# Altium project Roseta_Shield.PrjPCB
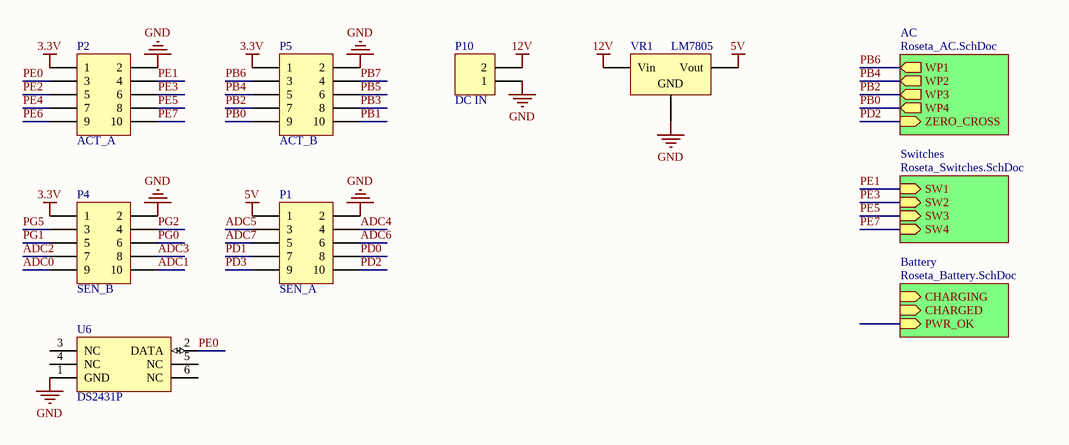
[diagram p0: Roseta_Shield.SchDoc]
4 sheets, 72 parts. Net scope: hierarchical (ports join the sheet entries above them; power ports are global).
Board file: Roseta_Shield.PcbDoc
Sheets:
  Roseta_Shield.SchDoc
    AC = Roseta_AC.SchDoc
    Switches = Roseta_Switches.SchDoc
    Battery = Roseta_Battery.SchDoc

## Sheet Roseta_Shield.SchDoc
size A4

### Parts
P1  SEN_A  [HDR2X5_Female_Slim]
P2  ACT_A  [HDR2X5_Female_Slim]
P4  SEN_B  [HDR2X5_Female_Slim]
P5  ACT_B  [HDR2X5_Female_Slim]
P10  DC IN  [TERMINAL BLOCK X2]
U6  DS2431P  [TSOC6]
VR1  LM7805  [TO254P1510-3_4N]

### Sub-sheets
AC = Roseta_AC.SchDoc: WP1 (out), WP2 (out), WP3 (out), WP4 (out), ZERO_CROSS (in)
Battery = Roseta_Battery.SchDoc: PWR_OK (in), CHARGED (in), CHARGING (in)
Switches = Roseta_Switches.SchDoc: SW1 (in), SW2 (in), SW3 (in), SW4 (in)

### Nets
3.3V: P2.1 P4.1 P5.1
5V: P1.1 VR1.3(Vout)
12V: P10.2 VR1.1(Vin)
GND: P1.2 P2.2 P4.2 P5.2 P10.1 U6.1(GND) VR1.2(GND)
ADC0: P4.9
ADC1: P4.10
ADC2: P4.7
ADC3: P4.8
ADC4: P1.4
ADC5: P1.3
ADC6: P1.6
ADC7: P1.5
PB0: P5.9 ; sheet AC/WP4
PB1: P5.10
PB2: P5.7 ; sheet AC/WP3
PB3: P5.8
PB4: P5.5 ; sheet AC/WP2
PB5: P5.6
PB6: P5.3 ; sheet AC/WP1
PB7: P5.4
PD0: P1.8
PD1: P1.7
PD2: P1.10 ; sheet AC/ZERO_CROSS
PD3: P1.9
PE0: P2.3 U6.2(DATA)
PE1: P2.4 ; sheet Switches/SW1
PE2: P2.5
PE3: P2.6 ; sheet Switches/SW2
PE4: P2.7
PE5: P2.8 ; sheet Switches/SW3
PE6: P2.9
PE7: P2.10 ; sheet Switches/SW4
PG0: P4.6
PG1: P4.5
PG2: P4.4
PG5: P4.3

Not connected (* = marked no-connect by the designer): U6 3(NC) 4(NC) 5(NC) 6(NC)

### Library data of the parts
P1 P2 P4 P5 = Header 5X2: Header, 5-Pin, Dual row; LatestRevisionDate: 17-Jul-2002; LatestRevisionNote: Re-released for DXP Platform.; Publisher: Altium Limited
P10 = Header 2: Header, 2-Pin; LatestRevisionDate: 17-Jul-2002; LatestRevisionNote: Re-released for DXP Platform.; Publisher: Altium Limited
U6 = DS2430AP: 256-Bit 1-Wire EEPROM; Note: Pin numbers 3-6 are Not Connected (NC); Published: 13-Oct-2000; LatestRevisionDate: 17-Jul-2002; LatestRevisionNote: Re-released for DXP Platform.; DatasheetVersion: 21-Oct-1999; PackageVersion: 1999; PackageReference: TSOC6; Publisher: Altium Limited; PackageDescription: Small Outline; 6 C-Bend Leads; Body Width 3.8 mm; Pitch 1.27 mm; ComponentLink1Description: Manufacturer Link; ComponentLink1URL: http://www.maxim-ic.com/; ComponentLink2Description: Datasheet; ComponentLink2URL: http://pdfserv.maxim-ic.com/en/ds/DS2430A.pdf
VR1 = Volt Reg: Voltage Regulator; Published: 24-Mar-1999; LatestRevisionDate: 29-May-2009; LatestRevisionNote: IPC-7351 Footprint Added.; PackageReference: D2PAK; Publisher: Altium Limited; PackageDescription: 3-Pin Transistor Outline Package 2.54 mm Pitch, 15.1 mm Lead Span

## Sheet Roseta_AC.SchDoc
size A4
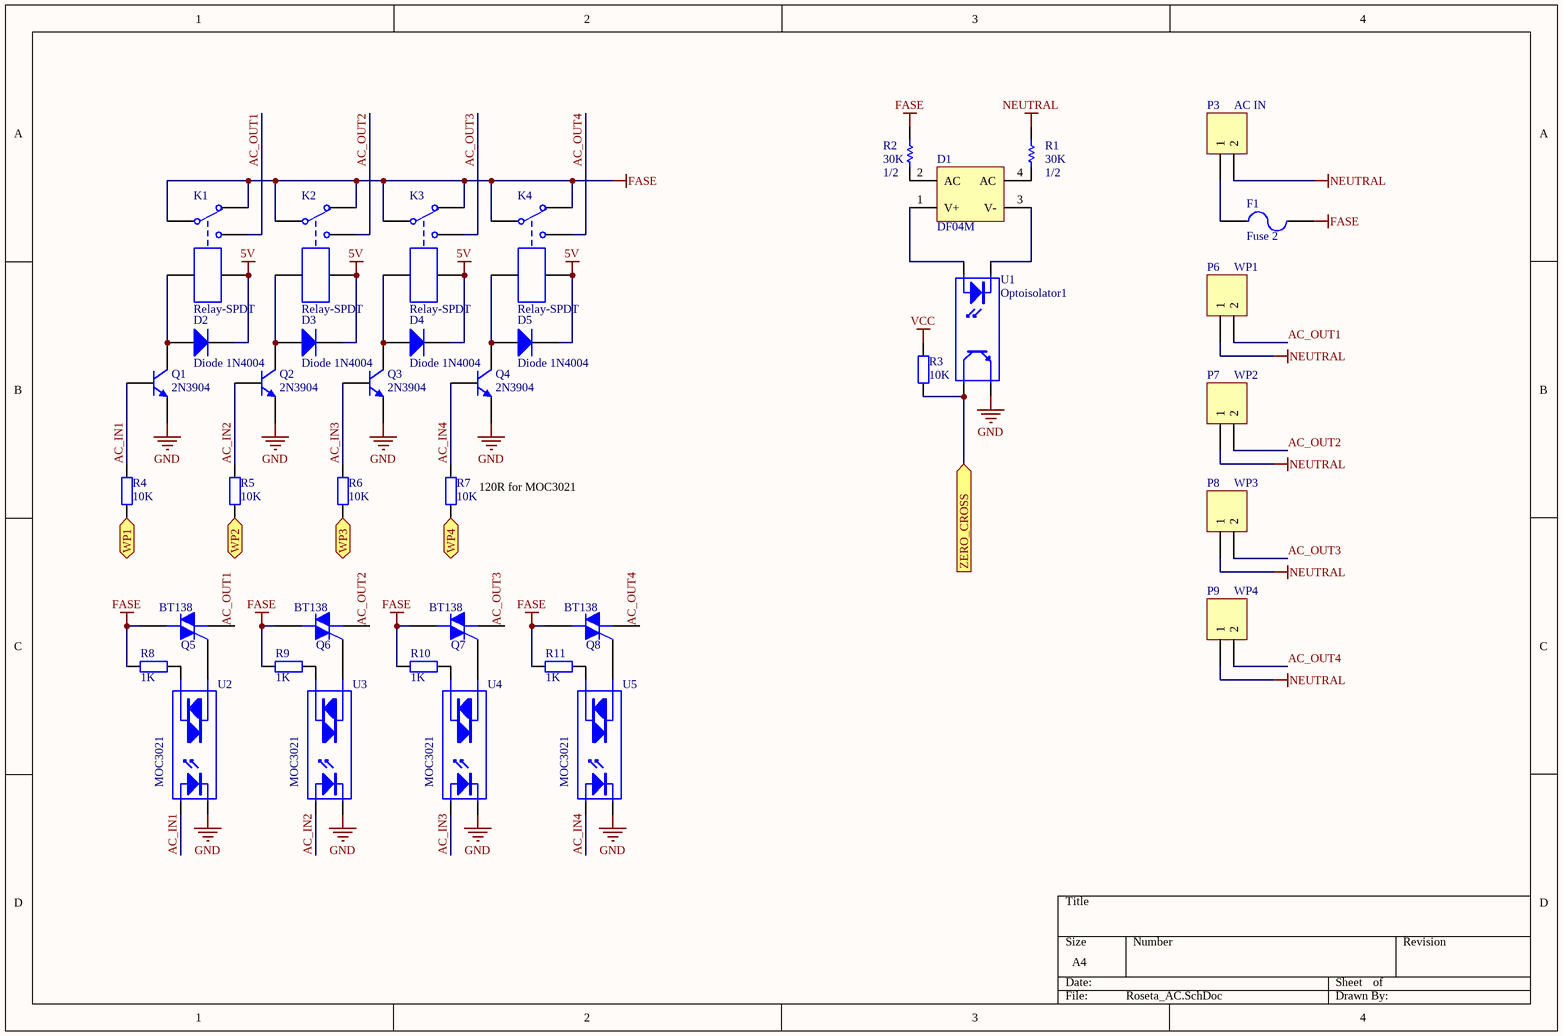
[diagram p1: Roseta_AC.SchDoc]

### Parts
D1  DF04M  [DF04M]
D2  Diode 1N4004  [1n4007]
D3  Diode 1N4004  [1n4007]
D4  Diode 1N4004  [1n4007]
D5  Diode 1N4004  [1n4007]
F1  Fuse 2  [PIN-W2/E2.8]
K1  Relay-SPDT  [RELAY-HRS4]
K2  Relay-SPDT  [RELAY-HRS4]
K3  Relay-SPDT  [RELAY-HRS4]
K4  Relay-SPDT  [RELAY-HRS4]
P3  AC IN  [TERMINAL BLOCK X2]
P6  WP1  [TERMINAL BLOCK X2]
P7  WP2  [TERMINAL BLOCK X2]
P8  WP3  [TERMINAL BLOCK X2]
P9  WP4  [TERMINAL BLOCK X2]
Q1  2N3904  [BCY-W3/E4]
Q2  2N3904  [BCY-W3/E4]
Q3  2N3904  [BCY-W3/E4]
Q4  2N3904  [BCY-W3/E4]
Q5  BT138  [221A-09]
Q6  BT138  [221A-09]
Q7  BT138  [221A-09]
Q8  BT138  [221A-09]
R1  1/2  value 30K  [AXIAL-0.3]
R2  1/2  value 30K  [AXIAL-0.3]
R3  value 10K  [1608[0603]]  (hidden comment: Res2)
R4  value 10K  [1608[0603]]  (hidden comment: Res2)
R5  value 10K  [1608[0603]]  (hidden comment: Res2)
R6  value 10K  [1608[0603]]  (hidden comment: Res2)
R7  value 10K  [1608[0603]]  (hidden comment: Res2)
R8  value 1K  [1608[0603]]  (hidden comment: Res2)
R9  value 1K  [1608[0603]]  (hidden comment: Res2)
R10  value 1K  [1608[0603]]  (hidden comment: Res2)
R11  value 1K  [1608[0603]]  (hidden comment: Res2)
U1  Optoisolator1  [DIP-6]
U2  MOC3021  [DIP-6]
U3  MOC3021  [DIP-6]
U4  MOC3021  [DIP-6]
U5  MOC3021  [DIP-6]

### Ports
WP1 (in), WP2 (in), WP3 (in), WP4 (in), ZERO_CROSS (in)

### Nets
5V: D2.2(K) D3.2(K) D4.2(K) D5.2(K) K1.5 K2.5 K3.5 K4.5
FASE: F1.1 K1.1 K1.2 K2.1 K2.2 K3.1 K3.2 K4.1 K4.2 Q5.2(M2) Q6.2(M2) Q7.2(M2) Q8.2(M2) R2.2 R8.2 R9.2 R10.2 R11.2
GND: Q1.1(E) Q2.1(E) Q3.1(E) Q4.1(E) U1.3(E) U2.2(K) U3.2(K) U4.2(K) U5.2(K)
NEUTRAL: P3.2 P6.1 P7.1 P8.1 P9.1 R1.2
VCC: R3.1
AC_IN1: Q1.2(B) R4.2 U2.1(A)
AC_IN2: Q2.2(B) R5.2 U3.1(A)
AC_IN3: Q3.2(B) R6.2 U4.1(A)
AC_IN4: Q4.2(B) R7.2 U5.1(A)
AC_OUT1: K1.3 P6.2 Q5.1(M1)
AC_OUT2: K2.3 P7.2 Q6.1(M1)
AC_OUT3: K3.3 P8.2 Q7.1(M1)
AC_OUT4: K4.3 P9.2 Q8.1(M1)
PB0: R7.1 ; port WP4
PB2: R6.1 ; port WP3
PB4: R5.1 ; port WP2
PB6: R4.1 ; port WP1
PD2: R3.2 U1.4(C) ; port ZERO_CROSS
NetD1_1: D1.1(V+) U1.1(A)
NetD1_2: D1.2(AC) R2.1
NetD1_3: D1.3(V-) U1.2(K)
NetD1_4: D1.4(AC) R1.1
NetD2_1: D2.1(A) K1.4 Q1.3(C)
NetD3_1: D3.1(A) K2.4 Q2.3(C)
NetD4_1: D4.1(A) K3.4 Q3.3(C)
NetD5_1: D5.1(A) K4.4 Q4.3(C)
NetF1_2: F1.2 P3.1
NetQ5_3: Q5.3(G) U2.4(A/K)
NetQ6_3: Q6.3(G) U3.4(A/K)
NetQ7_3: Q7.3(G) U4.4(A/K)
NetQ8_3: Q8.3(G) U5.4(A/K)
NetR8_1: R8.1 U2.3(A/K)
NetR9_1: R9.1 U3.3(A/K)
NetR10_1: R10.1 U4.3(A/K)
NetR11_1: R11.1 U5.3(A/K)

### Notes on the sheet
- (near R7) 120R for MOC3021

### Library data of the parts
D1 = Bridge2: Diode Bridge; Published: 24-Mar-1999; LatestRevisionDate: 17-Jul-2002; LatestRevisionNote: Re-released for DXP Platform.; PackageReference: D-46_6A; Publisher: Altium Limited
D2-D5 = Diode 1N4004: 1 Amp General Purpose Rectifier; Published: 8-Jun-2000; LatestRevisionDate: 17-Jul-2002; LatestRevisionNote: Re-released for DXP Platform.; DatasheetVersion: 1998; PackageVersion: Aug-1999; PackageReference: DO-41; Publisher: Altium Limited; Code_JEDEC: DO-204-AL; ComponentLink1Description: Manufacturer Link; ComponentLink1URL: http://www.fairchildsemi.com/; ComponentLink2Description: Datasheet; ComponentLink2URL: http://www.fairchildsemi.com/ds/1N%2F1N4001.pdf
F1 = Fuse 2: Fuse; Published: 8-Jun-2000; LatestRevisionDate: 17-Jul-2002; LatestRevisionNote: Re-released for DXP Platform.; PackageReference: PIN-W2/E2.8; Publisher: Altium Limited
K1-K4 = Relay-SPDT: Single-Pole Dual-Throw Relay; Published: 24-Mar-1999; LatestRevisionDate: 17-Jul-2002; LatestRevisionNote: Re-released for DXP Platform.; PackageReference: MODULE5B; Publisher: Altium Limited
P3 P6-P9 = Header 2: Header, 2-Pin; LatestRevisionDate: 17-Jul-2002; LatestRevisionNote: Re-released for DXP Platform.; Publisher: Altium Limited
Q1-Q4 = 2N3904: NPN General Purpose Amplifier; Published: 8-Jun-2000; LatestRevisionDate: 15-Jan-2003; LatestRevisionNote: PCB Footprint 'BCY-W3/D4.7' replaced; DatasheetVersion: 1997; PackageVersion: Sep-1998; PackageReference: TO-92A; Publisher: Altium Limited; Code_JEDEC: TO-92A; ComponentLink1Description: Manufacturer Link; ComponentLink1URL: http://www.fairchildsemi.com/; ComponentLink2Description: Datasheet; ComponentLink2URL: http://www.fairchildsemi.com/ds/2N%2F2N3904.pdf
Q5-Q8 = MAC15A6: Silicon Bidirectional Triode Thyristor; Note: Pin 2 is electrically connected to Pin 4 (TAB); Published: 29-Sep-2000; LatestRevisionDate: 17-Jul-2002; LatestRevisionNote: Re-released for DXP Platform.; DatasheetVersion: 1999; PackageVersion: 1997; PackageReference: 221A-09; Publisher: Altium Limited; PackageDescription: TO, Thru-Hole, Vertical, Heatsink Mounted; 3 In-Line Leads; Pitch 2.54 mm; Code_JEDEC: TO-262-AA; ComponentLink1Description: Manufacturer Link; ComponentLink1URL: http://www.onsemi.com/site/products/landing?taxonomyID=194; ComponentLink2Description: Datasheet; ComponentLink2URL: http://www.onsemi.com/pub/Collateral/MAC15A4-D.PDF
R1 R2 = Res1: Resistor; Published: 8-Jun-2000; LatestRevisionDate: 17-Jul-2002; LatestRevisionNote: Re-released for DXP Platform.; PackageReference: AXIAL-0.3; Publisher: Altium Limited
R3-R11 = Res2: Resistor; Published: 8-Jun-2000; LatestRevisionDate: 17-Jul-2002; LatestRevisionNote: Re-released for DXP Platform.; PackageReference: AXIAL-0.4; Publisher: Altium Limited
U1 = Optoisolator1: 4-Pin Phototransistor Optocoupler; pin to pad: 3>4 4>5; Published: 24-Mar-1999; LatestRevisionDate: 04-Mar-2005; LatestRevisionNote: Sch pins 3 & 4 Swapped.; DatasheetVersion: Nov-2003; PackageReference: DIP-4; Publisher: Altium Limited
U2-U5 = Opto TRIAC: Opto-Triac; pin to pad: 3>4 4>6; Published: 24-Mar-1999; LatestRevisionDate: 17-Jul-2002; LatestRevisionNote: Re-released for DXP Platform.; PackageReference: NPSIP4A; Publisher: Altium Limited

## Sheet Roseta_Switches.SchDoc
size A4
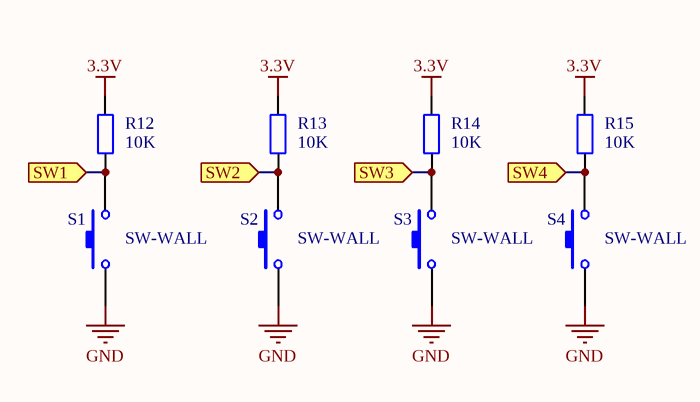
[diagram p2: Roseta_Switches.SchDoc]

### Parts
R12  value 10K  [1608[0603]]  (hidden comment: Res2)
R13  value 10K  [1608[0603]]  (hidden comment: Res2)
R14  value 10K  [1608[0603]]  (hidden comment: Res2)
R15  value 10K  [1608[0603]]  (hidden comment: Res2)
S1  SW-WALL  [TERMINAL BLOCK X2]
S2  SW-WALL  [TERMINAL BLOCK X2]
S3  SW-WALL  [TERMINAL BLOCK X2]
S4  SW-WALL  [TERMINAL BLOCK X2]

### Ports
SW1 (in), SW2 (in), SW3 (in), SW4 (in)

### Nets
3.3V: R12.1 R13.1 R14.1 R15.1
GND: S1.1 S2.1 S3.1 S4.1
PE1: R12.2 S1.2 ; port SW1
PE3: R13.2 S2.2 ; port SW2
PE5: R14.2 S3.2 ; port SW3
PE7: R15.2 S4.2 ; port SW4

### Library data of the parts
R12-R15 = Res2: Resistor; Published: 8-Jun-2000; LatestRevisionDate: 17-Jul-2002; LatestRevisionNote: Re-released for DXP Platform.; PackageReference: AXIAL-0.4; Publisher: Altium Limited
S1-S4 = SW-PB: Switch; Published: 24-Mar-1999; LatestRevisionDate: 17-Jul-2002; LatestRevisionNote: Re-released for DXP Platform.; PackageReference: SPST-2; Publisher: Altium Limited

## Sheet Roseta_Battery.SchDoc
size A4
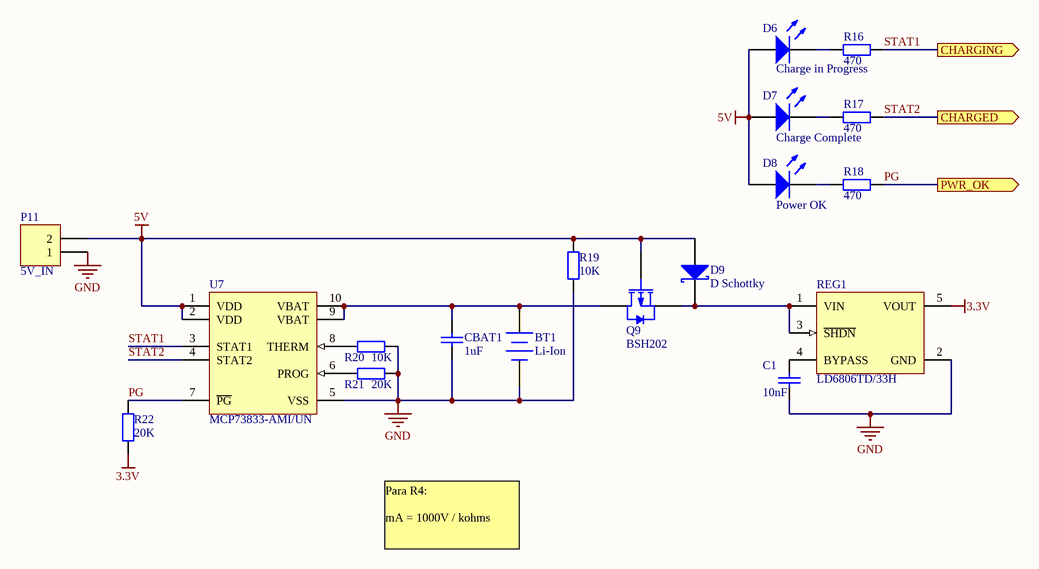
[diagram p3: Roseta_Battery.SchDoc]

### Parts
BT1  Li-Ion  [BAT-2]
C1  value 10nF  [1608[0603]]  (hidden comment: Cap)
CBAT1  value 1uF  [1608[0603]]  (hidden comment: Cap)
D6  Charge in Progress  [2013[0805]]
D7  Charge Complete  [2013[0805]]
D8  Power OK  [2013[0805]]
D9  D Schottky  [SOD123/X.85]
P11  5V_IN  [HDR1X2]
Q9  BSH202  [SOT95P240-3M]
R16  value 470  [1608[0603]]  (hidden comment: Res2)
R17  value 470  [1608[0603]]  (hidden comment: Res2)
R18  value 470  [1608[0603]]  (hidden comment: Res2)
R19  value 10K  [1608[0603]]  (hidden comment: Res2)
R20  value 10K  [1608[0603]]  (hidden comment: Res2)
R21  value 20K  [1608[0603]]  (hidden comment: Res2)
R22  value 20K  [1608[0603]]  (hidden comment: Res2)
REG1  LD6806TD/33H  [SOT-23-OT5_N]
U7  MCP73833-AMI/UN  [MSOP-UN10_N]

### Ports
CHARGED (out), CHARGING (out), PWR_OK (out)

### Nets
3.3V: R22.2 REG1.5(VOUT)
5V: D6.1 D7.1 D8.1 D9.1(A) P11.2 Q9.1(G) R19.1 U7.1(VDD) U7.2(VDD)
GND: BT1.2(-) C1.1 CBAT1.2 P11.1 R19.2 R20.1 R21.1 REG1.2(GND) U7.5(VSS)
PG: R18.2 R22.1 U7.7(~{PG}) ; port PWR_OK
STAT1: R16.2 U7.3(STAT1) ; port CHARGING
STAT2: R17.2 U7.4(STAT2) ; port CHARGED
NetBT1_1: BT1.1(+) CBAT1.1 Q9.3(D) U7.9(VBAT) U7.10(VBAT)
NetC1_2: C1.2 REG1.4(BYPASS)
NetD6_2: D6.2 R16.1
NetD7_2: D7.2 R17.1
NetD8_2: D8.2 R18.1
NetD9_2: D9.2(K) Q9.2(S) REG1.1(VIN) REG1.3(~{SHDN})
NetR20_2: R20.2 U7.8(THERM)
NetR21_2: R21.2 U7.6(PROG)

### Notes on the sheet
- Para R4:
  mA = 1000V / kohms

### Library data of the parts
BT1 = Battery: Multicell Battery; Published: 24-Mar-1999; LatestRevisionDate: 17-Jul-2002; LatestRevisionNote: Re-released for DXP Platform.; PackageReference: BAT-2; Publisher: Altium Limited
C1 CBAT1 = Cap: Capacitor; Published: 8-Jun-2000; LatestRevisionDate: 17-Jul-2002; LatestRevisionNote: Re-released for DXP Platform.; PackageReference: RAD-0.3; Publisher: Altium Limited
D6-D8 = LED SMD (0603)
D9 = D Schottky: Schottky Diode; Published: 8-Jun-2000; LatestRevisionDate: 17-Jul-2002; LatestRevisionNote: Re-released for DXP Platform.; PackageReference: SMB; Publisher: Altium Limited; Code_JEDEC: DO-214-AA
P11 = Header 2: Header, 2-Pin; LatestRevisionDate: 17-Jul-2002; LatestRevisionNote: Re-released for DXP Platform.; Publisher: Altium Limited
Q9 = BSH202: P-channel Enhancement Mode MOSFET; Published: 17-Sep-2003; LatestRevisionDate: 12-Dec-2006; LatestRevisionNote: IPC-7351 Footprint Added.; DatasheetVersion: Aug-1998; PackageVersion: May-1999; PackageReference: SOT23; Publisher: Altium Limited; PackageDescription: 3-Pin SOT-23 Package 0.95 mm Pitch, 2.3 mm Lead Span; ComponentLink1Description: Manufacturer Link; ComponentLink1URL: http://www.semiconductors.philips.com/; ComponentLink2Description: Datasheet; ComponentLink2URL: http://www.semiconductors.philips.com/acrobat/datasheets/BSH202_3.pdf
R16-R22 = Res2: Resistor; Published: 8-Jun-2000; LatestRevisionDate: 17-Jul-2002; LatestRevisionNote: Re-released for DXP Platform.; PackageReference: AXIAL-0.4; Publisher: Altium Limited
REG1 = TC1014-1.8VCT713: 50 mA, 100 mA and 150 mA CMOS LDOs with Active-Low Shutdown and Reference Bypass, 5-Pin SOT-23, Extended Temperature, Tape and Reel; FirstPublished: 29-Jan-2009; DatasheetVersion: revE, Feb-2007; PackageVersion: revBB, Aug-2009; PackageReference: SOT-23-CT5; Publisher: Altium Limited; PackageDescription: 5-Lead Plastic Small Outline Transistor (CT) [SOT-23]; Supplier 1: Digi-Key; Supplier Part Number 1: TC10141.8VCT713TR-ND; Supplier 2: Digi-Key; Supplier Part Number 2: TC10141.8VCT713CT-ND; Supplier 3: Digi-Key; Supplier Part Number 3: TC10141.8VCT713DKR-ND; Supplier 4: Farnell; Supplier Part Number 4: 1331500; Supplier 5: Newark; Supplier Part Number 5: 27C9045; Code_IPC: SOT23-5; ComponentLink1Description: Datasheet; ComponentLink1URL: http://ww1.microchip.com/downloads/en/DeviceDoc/21335e.pdf; ComponentLink2Description: Packaging Specification; ComponentLink2URL: http://www.microchip.com/stellent/groups/techpub_sg/documents/packagingspec/en012702.pdf; ComponentLink3Description: Microchip.com Home; ComponentLink3URL: http://www.microchip.com/
U7 = MCP73833-AMI/UN: Stand-Alone Linear Li-Ion/Li-Polymer Charge Management Controller with Power-Good Output, 4.2V, 10-Pin MSOP, Industrial Temperature; FirstPublished: 29-Jan-2009; LatestRevisionDate: 27-Nov-2009; LatestRevisionNote: Updated to datasheet revision B, May-2009; DatasheetVersion: revB, May-2009; PackageVersion: revBB, Aug-2009; PackageReference: MSOP-UN10; Publisher: Altium Limited; PackageDescription: 10-Lead Plastic Micro Small Outline Package (UN) [MSOP]; Supplier 1: Digi-Key; Supplier Part Number 1: MCP73833-AMI/UN-ND; Supplier 2: Farnell; Supplier Part Number 2: 1332160; Supplier 3: Newark; Supplier Part Number 3: 88K5664; ComponentLink1Description: Datasheet; ComponentLink1URL: http://ww1.microchip.com/downloads/en/DeviceDoc/22005b.pdf; ComponentLink2Description: Packaging Specification; ComponentLink2URL: http://www.microchip.com/stellent/groups/techpub_sg/documents/packagingspec/en012702.pdf; ComponentLink3Description: Microchip.com Home; ComponentLink3URL: http://www.microchip.com/

## Nets that join several sheets
3.3V: Roseta_Shield (P2.1 P4.1 P5.1), Roseta_Switches (R12.1 R13.1 R14.1 R15.1), Roseta_Battery (R22.2 REG1.5)
5V: Roseta_Shield (P1.1 VR1.3), Roseta_AC (8 pins), Roseta_Battery (9 pins)
GND: Roseta_Shield (7 pins), Roseta_AC (9 pins), Roseta_Switches (S1.1 S2.1 S3.1 S4.1), Roseta_Battery (9 pins)
PB0: Roseta_Shield (P5.9), Roseta_AC (R7.1)
PB2: Roseta_Shield (P5.7), Roseta_AC (R6.1)
PB4: Roseta_Shield (P5.5), Roseta_AC (R5.1)
PB6: Roseta_Shield (P5.3), Roseta_AC (R4.1)
PD2: Roseta_Shield (P1.10), Roseta_AC (R3.2 U1.4)
PE1: Roseta_Shield (P2.4), Roseta_Switches (R12.2 S1.2)
PE3: Roseta_Shield (P2.6), Roseta_Switches (R13.2 S2.2)
PE5: Roseta_Shield (P2.8), Roseta_Switches (R14.2 S3.2)
PE7: Roseta_Shield (P2.10), Roseta_Switches (R15.2 S4.2)